# Altium schematic sheet course.SchDoc
size A4
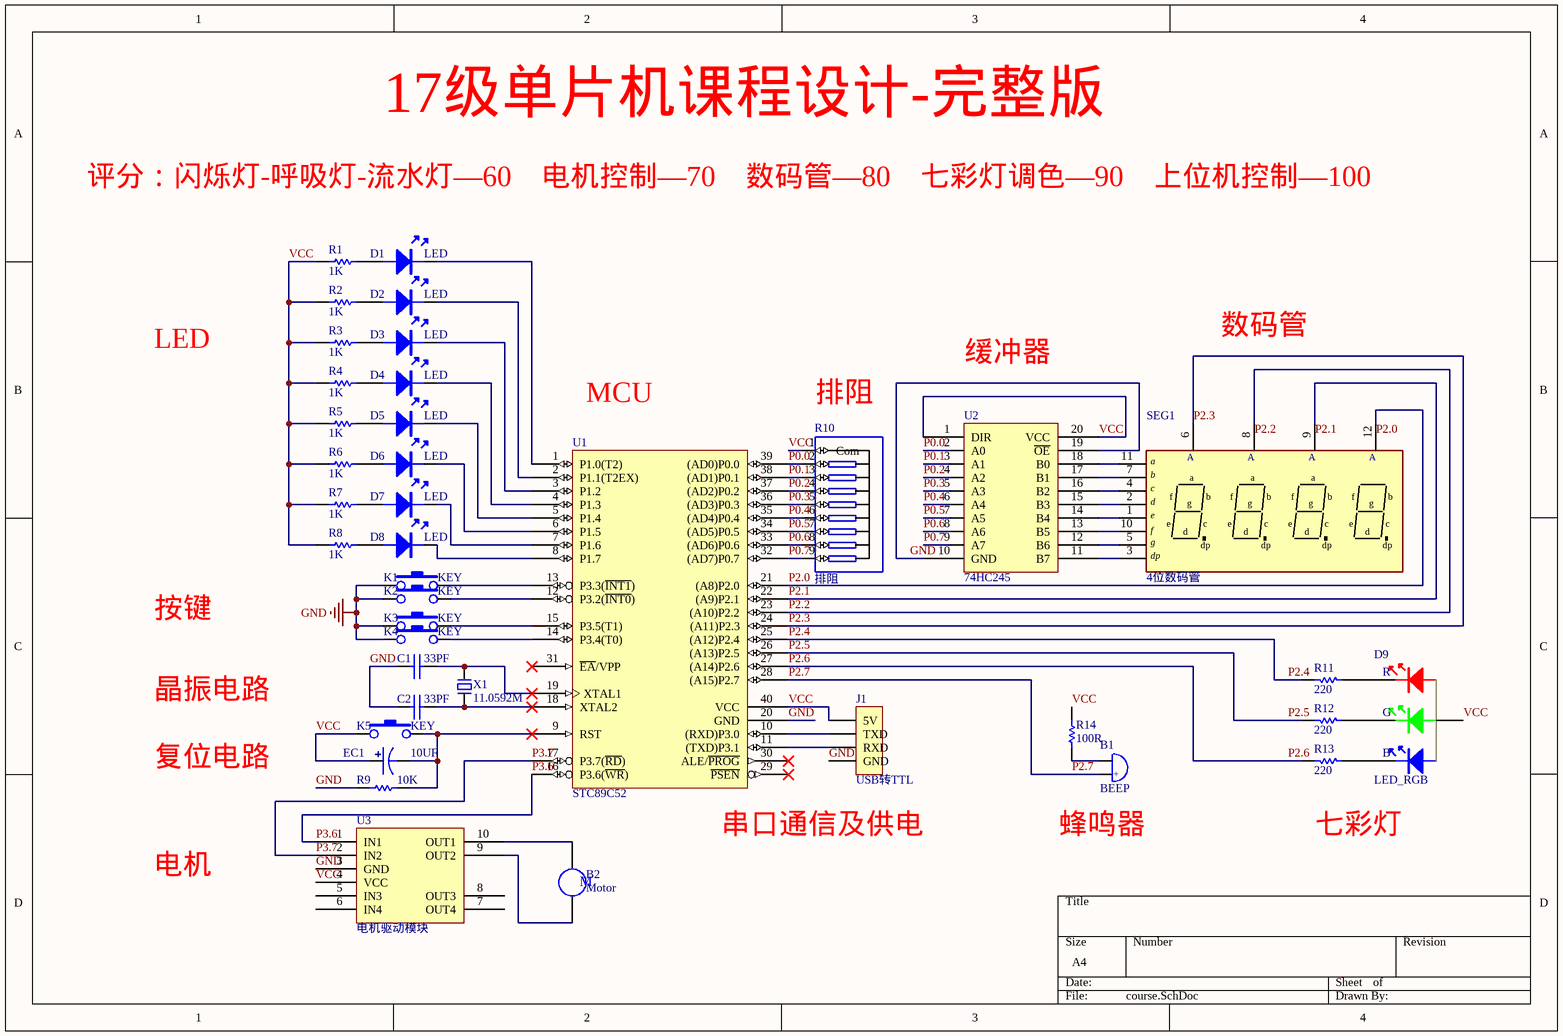
[diagram p0: course.SchDoc]

## Parts
B1  BEEP  [BEEP 5x9x5.5]
B2  Motor  [RB5-10.5]
C1  33PF  [0201C]
C2  33PF  [0201C]
D1  LED  [1WLED]
D2  LED  [1WLED]
D3  LED  [1WLED]
D4  LED  [1WLED]
D5  LED  [1WLED]
D6  LED  [1WLED]
D7  LED  [1WLED]
D8  LED  [1WLED]
D9  LED_RGB  [0805RGB]
EC1  10UF  [DIP-EC1.5X4X8]
J1  USB转TTL  [Pin HDR1X4/2.54mm-S]
K1  KEY  [DIP-3X6X4.3]
K2  KEY  [DIP-3X6X4.3]
K3  KEY  [DIP-3X6X4.3]
K4  KEY  [DIP-3X6X4.3]
K5  KEY  [DIP-3X6X4.3]
R1  1K  [0201R]
R2  1K  [0201R]
R3  1K  [0201R]
R4  1K  [0201R]
R5  1K  [0201R]
R6  1K  [0201R]
R7  1K  [0201R]
R8  1K  [0201R]
R9  10K  [0201R]
R10  排阻  [A09R]
R11  220  [0201R]
R12  220  [0201R]
R13  220  [0201R]
R14  100R  [0201R]
SEG1  4位数码管
U1  STC89C52  [DIP40]
U2  74HC245
U3  电机驱动模块
X1  11.0592M  [OSC 455E-LI]

## Nets
GND: C1.1 C2.1 J1.4(GND) K1.1 K2.1 K3.1 K4.1 R9.2 U1.20(GND) U2.10(GND) U2.19(~{OE}) U3.3(GND)
P0.0: R10.2 U1.39((AD0)P0.0) U2.2(A0)
P0.1: R10.3 U1.38((AD1)P0.1) U2.3(A1)
P0.2: R10.4 U1.37((AD2)P0.2) U2.4(A2)
P0.3: R10.5 U1.36((AD3)P0.3) U2.5(A3)
P0.4: R10.6 U1.35((AD4)P0.4) U2.6(A4)
P0.5: R10.7 U1.34((AD5)P0.5) U2.7(A5)
P0.6: R10.8 U1.33((AD6)P0.6) U2.8(A6)
P0.7: R10.9 U1.32((AD7)P0.7) U2.9(A7)
P2.0: SEG1.12 U1.21((A8)P2.0)
P2.1: SEG1.9 U1.22((A9)P2.1)
P2.2: SEG1.8 U1.23((A10)P2.2)
P2.3: SEG1.6 U1.24((A11)P2.3)
P2.4: R11.2 U1.25((A12)P2.4)
P2.5: R12.2 U1.26((A13)P2.5)
P2.6: R13.2 U1.27((A14)P2.6)
P2.7: B1.1 U1.28((A15)P2.7)
P3.6: U1.16(P3.6(~{WR})) U3.1(IN1)
P3.7: U1.17(P3.7(~{RD})) U3.2(IN2)
VCC: D9.3 EC1.1 J1.1(5V) K5.1 R1.1 R2.1 R3.1 R4.1 R5.1 R6.1 R7.1 R8.1 R10.1(Com) R14.2 U1.40(VCC) U2.1(DIR) U2.20(VCC) U3.4(VCC)
NetB1_2: B1.2 R14.1
NetB2_1: B2.1 U3.10(OUT1)
NetB2_2: B2.2 U3.9(OUT2)
NetC1_2: C1.2 U1.19(XTAL1) X1.2
NetC2_2: C2.2 U1.18(XTAL2) X1.1
NetD1_A: D1.A R1.2
NetD1_K: D1.K U1.1(P1.0(T2))
NetD2_A: D2.A R2.2
NetD2_K: D2.K U1.2(P1.1(T2EX))
NetD3_A: D3.A R3.2
NetD3_K: D3.K U1.3(P1.2)
NetD4_A: D4.A R4.2
NetD4_K: D4.K U1.4(P1.3)
NetD5_A: D5.A R5.2
NetD5_K: D5.K U1.5(P1.4)
NetD6_A: D6.A R6.2
NetD6_K: D6.K U1.6(P1.5)
NetD7_A: D7.A R7.2
NetD7_K: D7.K U1.7(P1.6)
NetD8_A: D8.A R8.2
NetD8_K: D8.K U1.8(P1.7)
NetD9_1: D9.1 R11.1
NetD9_2: D9.2 R12.1
NetD9_4: D9.4 R13.1
NetEC1_2: EC1.2 K5.3 R9.1 U1.9(RST)
NetJ1_2: J1.2(TXD) U1.10((RXD)P3.0)
NetJ1_3: J1.3(RXD) U1.11((TXD)P3.1)
NetK1_3: K1.3 U1.13(P3.3(~{INT1}))
NetK2_3: K2.3 U1.12(P3.2(~{INT0}))
NetK3_3: K3.3 U1.15(P3.5(T1))
NetK4_3: K4.3 U1.14(P3.4(T0))
NetSEG1_1: SEG1.1 U2.14(B4)
NetSEG1_2: SEG1.2 U2.15(B3)
NetSEG1_3: SEG1.3 U2.11(B7)
NetSEG1_4: SEG1.4 U2.16(B2)
NetSEG1_5: SEG1.5 U2.12(B6)
NetSEG1_7: SEG1.7 U2.17(B1)
NetSEG1_10: SEG1.10 U2.13(B5)
NetSEG1_11: SEG1.11 U2.18(B0)

Not connected (* = marked no-connect by the designer): U1 29(~{PSEN})* 30(ALE/~{PROG})* 31(~{EA}/VPP)*; U3 5(IN3) 6(IN4) 7(OUT4) 8(OUT3)

## Notes on the sheet
- 17级单片机课程设计-完整版
- 评分：闪烁灯-呼吸灯-流水灯—60    电机控制—70    数码管—80    七彩灯调色—90    上位机控制—100
- LED
- 缓冲器
- 数码管
- MCU
- (near R10) 排阻
- 按键
- 晶振电路
- 复位电路
- (near U1) 串口通信及供电
- (near B1) 蜂鸣器
- 七彩灯
- 电机
- Labels drawn without touching a wire or pin: P2.0, P2.1, P2.2
- (in symbol 0.28IN-4-A) A; a; b; c; f; d; g; e; dp
- (in symbol BEEP) +
- (in symbol LED_RGB) R; G; B
- (in symbol Motor) M

## Library data of the parts
B1 = BEEP: 蜂鸣器
B2 = Motor: Motor, General Kind; Published: 24-Mar-1999; LatestRevisionDate: 17-Jul-2002; LatestRevisionNote: Re-released for DXP Platform.; PackageReference: RB5-10.5; Publisher: Altium Limited; PackageDescription: Capacitor (Radial); 2 Leads
C1 C2 = CAP: 无极性电容
D9 = LED_RGB: 贴片0805， 深圳市追芯电子
EC1 = DIP_ECAP: 直插电解电容
J1 = Pin HDR1X4
R1-R9 R11-R14 = RES
R10 = RES_PACK9
SEG1 = 0.28IN-4-A: 4位0.28寸共阳数码管
U3 = L298N
X1 = XTAL-2P: 2脚无源脚晶振